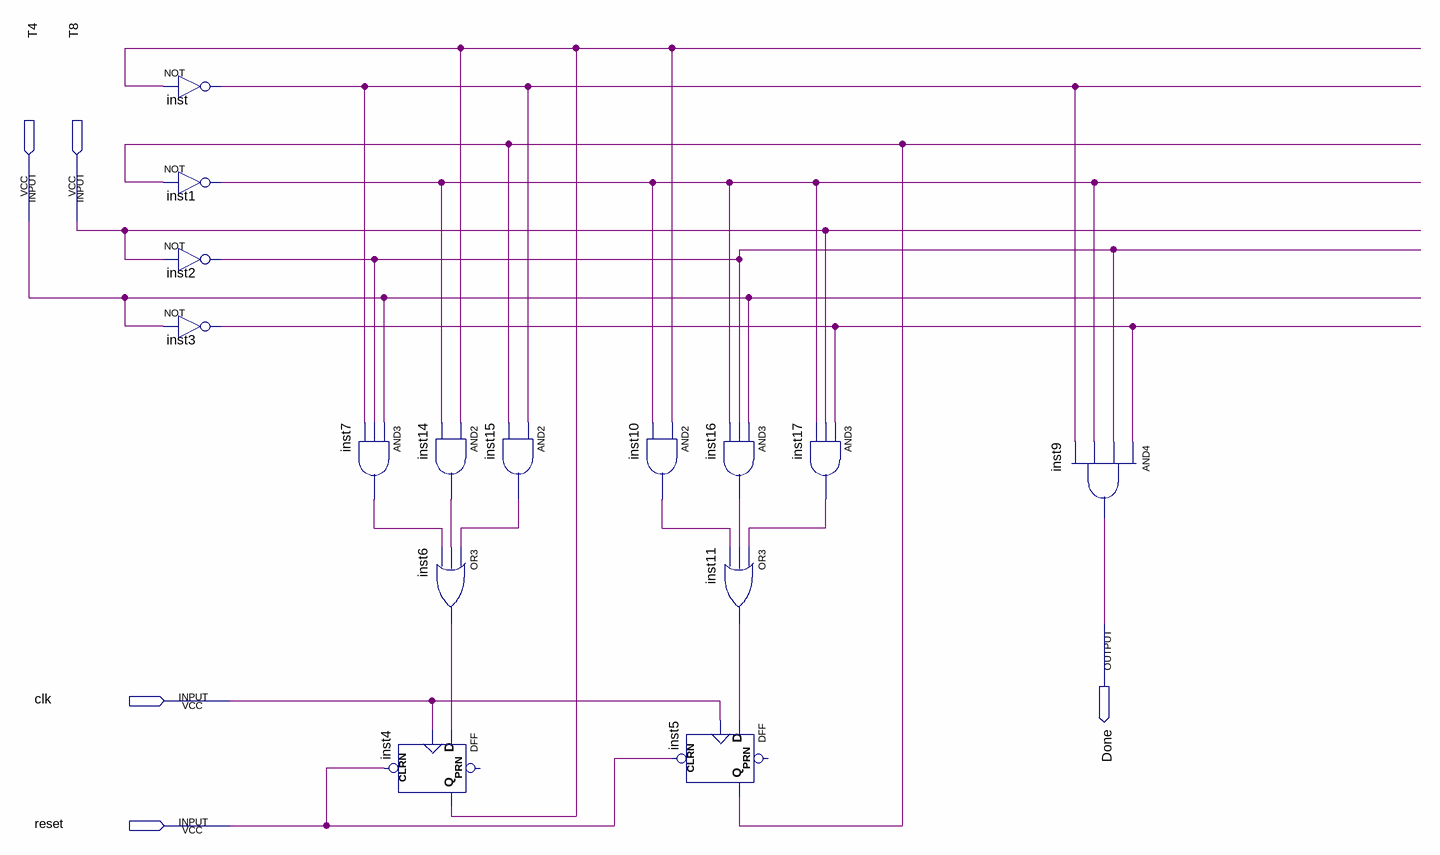
[diagram p0: schematic sheet]
// Quartus schematic 48timer.bdf as structural Verilog: 15 symbols, 5 pins
module \48timer  (
  input  T4,
  input  T8,
  input  clk,
  input  reset,
  output Done
);

  wire inst1_out, inst2_out, inst3_out, inst4_q, inst5_q, inst6_out, inst7_out, inst10_out, inst11_out,
       inst14_out, inst15_out, inst16_out, inst17_out, inst_out;

  not inst (inst_out, inst4_q);
  not inst1 (inst1_out, inst5_q);
  not inst2 (inst2_out, T8);
  not inst3 (inst3_out, T4);
  and inst7 (inst7_out, T4, inst2_out, inst_out);
  DFF inst4 (.CLRN(reset), .CLK(clk), .D(inst6_out), .Q(inst4_q));  // open: PRN
  and inst14 (inst14_out, inst4_q, inst1_out);
  or inst6 (inst6_out, inst15_out, inst14_out, inst7_out);
  and inst15 (inst15_out, inst_out, inst5_q);
  and inst10 (inst10_out, inst4_q, inst1_out);
  DFF inst5 (.CLRN(reset), .CLK(clk), .D(inst11_out), .Q(inst5_q));  // open: PRN
  and inst16 (inst16_out, T4, inst2_out, inst1_out);
  or inst11 (inst11_out, inst17_out, inst16_out, inst10_out);
  and inst17 (inst17_out, inst3_out, T8, inst1_out);
  and inst9 (Done, inst3_out, inst2_out, inst1_out, inst_out);
endmodule
